# Altium schematic sheet Sheet2.SchDoc
size A4
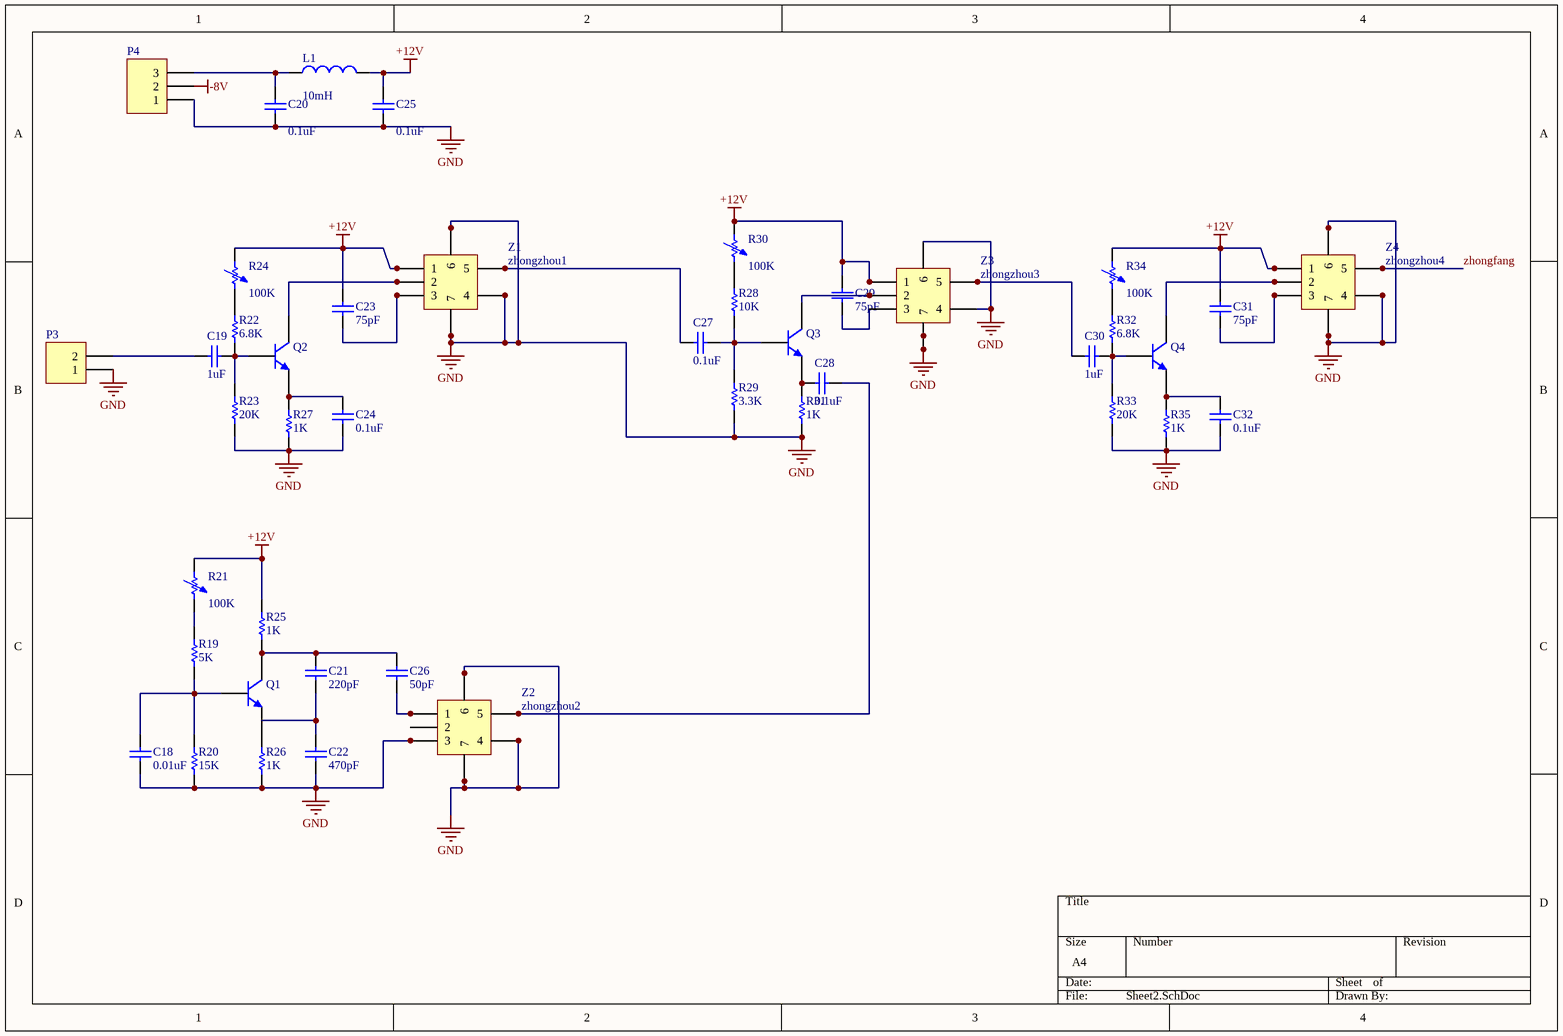
[diagram p0: Sheet2.SchDoc]

## Parts
C18  value 0.01uF  [2012[0805]]  (hidden comment: Cap)
C19  value 1uF  [2012[0805]]  (hidden comment: Cap)
C20  value 0.1uF  [2012[0805]]  (hidden comment: Cap)
C21  value 220pF  [2012[0805]]  (hidden comment: Cap)
C22  value 470pF  [2012[0805]]  (hidden comment: Cap)
C23  value 75pF  [2012[0805]]  (hidden comment: Cap)
C24  value 0.1uF  [2012[0805]]  (hidden comment: Cap)
C25  value 0.1uF  [2012[0805]]  (hidden comment: Cap)
C26  value 50pF  [2012[0805]]  (hidden comment: Cap)
C27  value 0.1uF  [2012[0805]]  (hidden comment: Cap)
C28  value 0.1uF  [2012[0805]]  (hidden comment: Cap)
C29  value 75pF  [2012[0805]]  (hidden comment: Cap)
C30  value 1uF  [2012[0805]]  (hidden comment: Cap)
C31  value 75pF  [2012[0805]]  (hidden comment: Cap)
C32  value 0.1uF  [2012[0805]]  (hidden comment: Cap)
L1  value 10mH  [2012[0805]]  (hidden comment: Inductor)
P3  Header 2  [HDR1X2]  (value not drawn)
P4  Header 3  [shuru]  (value not drawn)
Q1  NPN  [TO-226]  (value not drawn)
Q2  NPN  [TO-226]  (value not drawn)
Q3  NPN  [TO-226]  (value not drawn)
Q4  NPN  [TO-226]  (value not drawn)
R19  value 5K  [2012[0805]]  (hidden comment: Res1)
R20  value 15K  [2012[0805]]  (hidden comment: Res1)
R21  value 100K  [2012[0805]]  (hidden comment: Res Adj1)
R22  value 6.8K  [2012[0805]]  (hidden comment: Res1)
R23  value 20K  [2012[0805]]  (hidden comment: Res1)
R24  value 100K  [2012[0805]]  (hidden comment: Res Adj1)
R25  value 1K  [2012[0805]]  (hidden comment: Res1)
R26  value 1K  [2012[0805]]  (hidden comment: Res1)
R27  value 1K  [2012[0805]]  (hidden comment: Res1)
R28  value 10K  [2012[0805]]  (hidden comment: Res1)
R29  value 3.3K  [2012[0805]]  (hidden comment: Res1)
R30  value 100K  [2012[0805]]  (hidden comment: Res Adj1)
R31  value 1K  [2012[0805]]  (hidden comment: Res1)
R32  value 6.8K  [2012[0805]]  (hidden comment: Res1)
R33  value 20K  [2012[0805]]  (hidden comment: Res1)
R34  value 100K  [2012[0805]]  (hidden comment: Res Adj1)
R35  value 1K  [2012[0805]]  (hidden comment: Res1)
Z1  zhongzhou1  [zhongzhou]
Z2  zhongzhou2  [zhongzhou]
Z3  zhongzhou3  [zhongzhou]
Z4  zhongzhou4  [zhongzhou]

## Nets
+12V: C23.1 C25.2 C29.1 C31.1 L1.2 R21.1 R24.1 R25.2 R30.1 R34.1 Z1.1 Z3.1 Z4.1
-8V: P4.2
GND: C18.2 C20.1 C22.2 C24.1 C25.1 C32.1 P3.1 P4.1 R20.1 R23.1 R26.1 R27.1 R29.1 R31.1 R33.1 R35.1 Z1.4 Z1.6 Z1.7 Z2.3 Z2.4 Z2.6 Z2.7 Z3.4 Z3.6 Z3.7 Z4.4 Z4.6 Z4.7
zhongfang: Z4.5
NetC18_1: C18.1 Q1.2(B) R19.1 R20.2
NetC19_1: C19.1 P3.2
NetC19_2: C19.2 Q2.2(B) R22.1 R23.2
NetC20_2: C20.2 L1.1 P4.3
NetC21_1: C21.1 C26.2 Q1.1(C) R25.1
NetC21_2: C21.2 C22.1
NetC23_2: C23.2 Z1.3
NetC24_2: C24.2 Q2.3(E) R27.2
NetC26_1: C26.1 Z2.1
NetC27_1: C27.1 Z1.5
NetC27_2: C27.2 Q3.2(B) R28.1 R29.2
NetC28_1: C28.1 Q3.3(E) R31.2
NetC28_2: C28.2 Z2.5
NetC29_2: C29.2 Z3.3
NetC30_1: C30.1 Z3.5
NetC30_2: C30.2 Q4.2(B) R32.1 R33.2
NetC31_2: C31.2 Z4.3
NetC32_2: C32.2 Q4.3(E) R35.2
NetQ1_3: Q1.3(E) R26.2
NetQ2_1: Q2.1(C) Z1.2
NetQ3_1: Q3.1(C) Z3.2
NetQ4_1: Q4.1(C) Z4.2
NetR19_2: R19.2 R21.2
NetR22_2: R22.2 R24.2
NetR28_2: R28.2 R30.2
NetR32_2: R32.2 R34.2

Not connected (* = marked no-connect by the designer): Z2 2

## Library data of the parts
C18-C32 = Cap: Capacitor; Published: 8-Jun-2000; LatestRevisionDate: 17-Jul-2002; LatestRevisionNote: Re-released for DXP Platform.; PackageReference: RAD-0.3; Publisher: Altium Limited
L1 = Inductor: Code_IEC: 1005; Published: 8-Jun-2000; LatestRevisionDate: 17-Jul-2002; LatestRevisionNote: Re-released for DXP Platform.; PackageReference: 0402-A; Publisher: Altium Limited; Code_JEITA: 0402
P3 = Header 2: Header, 2-Pin; LatestRevisionDate: 17-Jul-2002; LatestRevisionNote: Re-released for DXP Platform.; Publisher: Altium Limited
P4 = Header 3: Header, 3-Pin; LatestRevisionDate: 17-Jul-2002; LatestRevisionNote: Re-released for DXP Platform.; Publisher: Altium Limited
Q1-Q4 = NPN: NPN Bipolar Transistor; Published: 8-Jun-2000; LatestRevisionDate: 17-Jul-2002; LatestRevisionNote: Re-released for DXP Platform.; PackageReference: TO-226; Publisher: Altium Limited; Code_JEDEC: TO-226-AA
R19 R20 R22 R23 R25-R29 R31-R33 R35 = Res1: Resistor; Published: 8-Jun-2000; LatestRevisionDate: 17-Jul-2002; LatestRevisionNote: Re-released for DXP Platform.; PackageReference: AXIAL-0.3; Publisher: Altium Limited
R21 R24 R30 R34 = Res Adj1: Variable Resistor; Set Position: 0.5; Published: 8-Jun-2000; LatestRevisionDate: 17-Jul-2002; LatestRevisionNote: Re-released for DXP Platform.; PackageReference: AXIAL-0.7; Publisher: Altium Limited